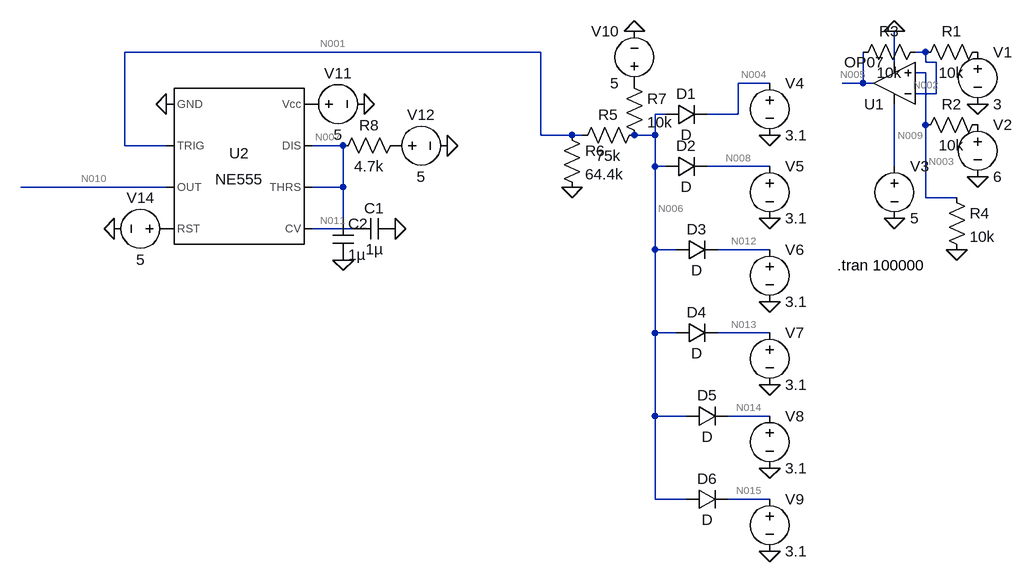
[diagram p0: schematic BatteryProtectionSim.asc]
BatteryProtectionSim.asc, the LTspice schematic file:
Version 4.1
SHEET 1 880 884
WIRE -288 96 -928 96
WIRE 304 96 288 96
WIRE 256 112 256 64
WIRE 304 112 304 96
WIRE 320 112 304 112
WIRE 304 128 288 128
WIRE 64 144 16 144
WIRE 208 144 208 96
WIRE 208 144 176 144
WIRE 224 144 208 144
WIRE 320 160 320 112
WIRE 320 160 288 160
WIRE -96 192 -112 192
WIRE 16 192 16 144
WIRE 16 192 -32 192
WIRE 304 208 304 128
WIRE -288 224 -288 96
WIRE -240 224 -288 224
WIRE -224 224 -240 224
WIRE -112 224 -112 192
WIRE -112 224 -144 224
WIRE -928 240 -928 96
WIRE -864 240 -928 240
WIRE -592 240 -640 240
WIRE -112 272 -112 224
WIRE -96 272 -112 272
WIRE 64 272 -32 272
WIRE 256 272 256 176
WIRE -864 304 -1088 304
WIRE -592 304 -592 240
WIRE -592 304 -640 304
WIRE 304 320 304 208
WIRE 352 320 304 320
WIRE -592 352 -592 304
WIRE -576 368 -640 368
WIRE -112 400 -112 272
WIRE -80 400 -112 400
WIRE 64 400 -16 400
WIRE -112 528 -112 400
WIRE -80 528 -112 528
WIRE 64 528 -16 528
WIRE -112 656 -112 528
WIRE -64 656 -112 656
WIRE 64 656 0 656
WIRE -112 784 -112 656
WIRE -64 784 -112 784
WIRE 64 784 0 784
FLAG 384 176 0
FLAG 384 288 0
FLAG 256 64 0
FLAG 256 352 0
FLAG 352 400 0
FLAG 64 224 0
FLAG 64 352 0
FLAG 64 608 0
FLAG 64 480 0
FLAG 64 736 0
FLAG 64 864 0
FLAG -240 304 0
FLAG -144 64 0
FLAG -512 368 0
FLAG -560 176 0
FLAG -592 416 0
FLAG -432 240 0
FLAG -864 176 0
FLAG -944 368 0
SYMBOL OpAmps\\OP07 256 208 R180
SYMATTR InstName U1
SYMBOL voltage 384 80 R0
SYMATTR InstName V1
SYMATTR Value 3
SYMBOL voltage 384 192 R0
WINDOW 123 0 0 Left 0
WINDOW 39 0 0 Left 0
SYMATTR InstName V2
SYMATTR Value 6
SYMBOL voltage 256 256 R0
SYMATTR InstName V3
SYMATTR Value 5
SYMBOL res 400 80 R90
WINDOW 0 0 56 VBottom 2
WINDOW 3 32 56 VTop 2
SYMATTR InstName R1
SYMATTR Value 10k
SYMBOL res 400 192 R90
WINDOW 0 0 56 VBottom 2
WINDOW 3 32 56 VTop 2
SYMATTR InstName R2
SYMATTR Value 10k
SYMBOL res 304 80 R90
WINDOW 0 0 56 VBottom 2
WINDOW 3 32 56 VTop 2
SYMATTR InstName R3
SYMATTR Value 10k
SYMBOL res 336 304 R0
SYMATTR InstName R4
SYMATTR Value 10k
SYMBOL voltage 64 128 R0
SYMATTR InstName V4
SYMATTR Value 3.1
SYMBOL voltage 64 256 R0
SYMATTR InstName V5
SYMATTR Value 3.1
SYMBOL diode -96 208 R270
WINDOW 0 32 32 VTop 2
WINDOW 3 0 32 VBottom 2
SYMATTR InstName D1
SYMBOL diode -96 288 R270
WINDOW 0 32 32 VTop 2
WINDOW 3 0 32 VBottom 2
SYMATTR InstName D2
SYMBOL voltage 64 384 R0
SYMATTR InstName V6
SYMATTR Value 3.1
SYMBOL voltage 64 512 R0
SYMATTR InstName V7
SYMATTR Value 3.1
SYMBOL voltage 64 640 R0
SYMATTR InstName V8
SYMATTR Value 3.1
SYMBOL voltage 64 768 R0
SYMATTR InstName V9
SYMATTR Value 3.1
SYMBOL diode -80 416 R270
WINDOW 0 32 32 VTop 2
WINDOW 3 0 32 VBottom 2
SYMATTR InstName D3
SYMBOL diode -80 544 R270
WINDOW 0 32 32 VTop 2
WINDOW 3 0 32 VBottom 2
SYMATTR InstName D4
SYMBOL diode -64 672 R270
WINDOW 0 32 32 VTop 2
WINDOW 3 0 32 VBottom 2
SYMATTR InstName D5
SYMBOL diode -64 800 R270
WINDOW 0 32 32 VTop 2
WINDOW 3 0 32 VBottom 2
SYMATTR InstName D6
SYMBOL res -128 208 R90
WINDOW 0 0 56 VBottom 2
WINDOW 3 32 56 VTop 2
SYMATTR InstName R5
SYMATTR Value 75k
SYMBOL res -256 208 R0
SYMATTR InstName R6
SYMATTR Value 64.4k
SYMBOL res -160 128 R0
SYMATTR InstName R7
SYMATTR Value 10k
SYMBOL voltage -144 160 R180
WINDOW 0 24 96 Left 2
WINDOW 3 24 16 Left 2
SYMATTR InstName V10
SYMATTR Value 5
SYMBOL Misc\\NE555 -752 272 R0
SYMATTR InstName U2
SYMBOL cap -512 352 R90
WINDOW 0 0 32 VBottom 2
WINDOW 3 32 32 VTop 2
SYMATTR InstName C1
SYMATTR Value 1µ
SYMBOL voltage -656 176 R270
WINDOW 0 32 56 VTop 2
WINDOW 3 -32 56 VBottom 2
SYMATTR InstName V11
SYMATTR Value 5
SYMBOL cap -608 352 R0
SYMATTR InstName C2
SYMATTR Value 1µ
SYMBOL res -496 224 R90
WINDOW 0 0 56 VBottom 2
WINDOW 3 32 56 VTop 2
SYMATTR InstName R8
SYMATTR Value 4.7k
SYMBOL voltage -528 240 R270
WINDOW 0 32 56 VTop 2
WINDOW 3 -32 56 VBottom 2
SYMATTR InstName V12
SYMATTR Value 5
SYMBOL voltage -848 368 R90
WINDOW 0 -32 56 VBottom 2
WINDOW 3 32 56 VTop 2
SYMATTR InstName V14
SYMATTR Value 5
TEXT 168 424 Left 2 !.tran 100000

The netlist it stands for:
* BatteryProtectionSim.asc
X§U1 N003 N002 N009 0 N005 LT1001  ; OP07, pins In+ In- V+ V- OUT
V1 P001 0 3
V2 P002 0 6
V3 N009 0 5
R1 P001 N002 10k
R2 P002 N003 10k
R3 N002 N005 10k
R4 N003 0 10k
V4 N004 0 3.1
V5 N008 0 3.1
D1 N006 N004 D
D2 N006 N008 D
V6 N012 0 3.1
V7 N013 0 3.1
V8 N014 0 3.1
V9 N015 0 3.1
D3 N006 N012 D
D4 N006 N013 D
D5 N006 N014 D
D6 N006 N015 D
R5 N006 N001 75k
R6 N001 0 64.4k
R7 P003 N006 10k
V10 P003 0 5
X§U2 0 N001 N010 P004 N011 N007 N007 P005 NE555  ; pins GND TRIG OUT RST CV THRS DIS Vcc
C1 0 N011 1µ
V11 P005 0 5
C2 N007 0 1µ
R8 P006 N007 4.7k
V12 P006 0 5
V14 P004 0 5
.model D D
.lib standard.dio
.tran 100000
.lib LTC.lib
.lib NE555.sub
.backanno
.end

* Results of the author's LTspice run, read from the files saved beside the schematic
* Operating Point, zero values left out:
*   V(n001) = 1.687 V
*   V(n002) = 3 V
*   V(n003) = 3 V
*   V(n004) = 3.1 V
*   V(n005) = 3 V
*   V(n006) = 3.651 V
*   V(n007) = 5 V
*   V(n008) = 3.1 V
*   V(n009) = 5 V
*   V(n010) = 5 V
*   V(n011) = 3.333 V
*   V(n012) = 3.1 V
*   V(n013) = 3.1 V
*   V(n014) = 3.1 V
*   V(n015) = 3.1 V
*   V(p001) = 3 V
*   V(p002) = 6 V
*   V(p003) = 5 V
*   V(p004) = 5 V
*   V(p005) = 5 V
*   V(p006) = 5 V
*   I(D1) = 18.11 µA
*   I(D2) = 18.11 µA
*   I(D3) = 18.11 µA
*   I(D4) = 18.11 µA
*   I(D5) = 18.11 µA
*   I(D6) = 18.11 µA
*   I(R1) = 69.11 pA
*   I(R2) = 300 µA
*   I(R3) = 68.23 pA
*   I(R4) = 300 µA
*   I(R5) = 26.19 µA
*   I(R6) = 26.19 µA
*   I(R7) = 134.9 µA
*   I(R8) = 11.67 nA
*   I(V1) = -69.11 pA
*   I(V10) = -134.9 µA
*   I(V11) = -1.588 mA
*   I(V12) = -11.67 nA
*   I(V14) = -22.67 µA
*   I(V2) = -300 µA
*   I(V3) = -2.25 mA
*   I(V4) = 18.11 µA
*   I(V5) = 18.11 µA
*   I(V6) = 18.11 µA
*   I(V7) = 18.11 µA
*   I(V8) = 18.11 µA
*   I(V9) = 18.11 µA
*   Ix(u1:3) = 2.25 mA
*   Ix(u1:4) = -2.25 mA
*   Ix(u1:5) = 67.23 pA
*   Ix(u2:1) = -1.611 mA
*   Ix(u2:2) = 1.687 nA
*   Ix(u2:4) = 22.67 µA
*   Ix(u2:6) = 5 nA
*   Ix(u2:7) = 6.672 nA
*   Ix(u2:8) = 1.588 mA
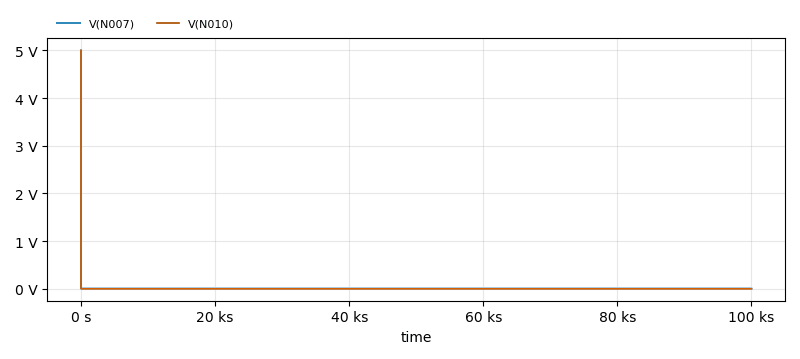
[diagram p1: Transient Analysis of BatteryProtectionSim.asc, plotted from the saved traces]
* Transient Analysis, 1 run:
*   V(N007): min 6.375 mV, max 5 V, average 6.375 mV, rms 6.375 mV, last 6.375 mV
*   V(N010): min 30 µV, max 5 V, average 30 µV, rms 30.44 µV, last 30 µV